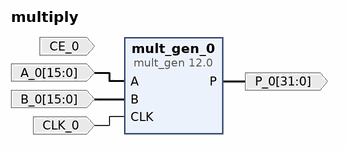
[diagram p0: block diagram of the top level]
# Vivado block design multiply, xck26-sfvc784-2LV-c, Vivado 2024.1
create_bd_design multiply

create_bd_port -dir O -from 31 -to 0 -type data P_0
create_bd_port -dir I -from 15 -to 0 -type data A_0
create_bd_port -dir I -from 15 -to 0 -type data B_0
create_bd_port -dir I -type clk CLK_0
set_property -dict {CONFIG.FREQ_HZ 50000000} [get_bd_ports CLK_0]
create_bd_port -dir I -type ce CE_0
set_property -dict {CONFIG.POLARITY ACTIVE_HIGH} [get_bd_ports CE_0]

create_bd_cell -type ip -vlnv xilinx.com:ip:mult_gen:12.0 mult_gen_0
set_property -dict [list \
  CONFIG.ClockEnable true \
  CONFIG.MultType Parallel_Multiplier \
  CONFIG.Multiplier_Construction Use_Mults \
  CONFIG.OptGoal Speed \
  CONFIG.PipeStages 1 \
  CONFIG.PortAType Signed \
  CONFIG.PortAWidth 16 \
  CONFIG.PortBType Signed \
  CONFIG.PortBWidth 16 \
  CONFIG.SyncClear false \
] [get_bd_cells mult_gen_0]

# ---- connections ----

connect_bd_net -net A_0_1 [get_bd_ports A_0] [get_bd_pins mult_gen_0/A]
connect_bd_net -net B_0_1 [get_bd_ports B_0] [get_bd_pins mult_gen_0/B]
connect_bd_net -net CLK_0_1 [get_bd_ports CLK_0] [get_bd_pins mult_gen_0/CLK]
connect_bd_net [get_bd_pins mult_gen_0/P] [get_bd_ports P_0]

validate_bd_design
save_bd_design
